# Altium schematic sheet ADC.SchDoc
size A4
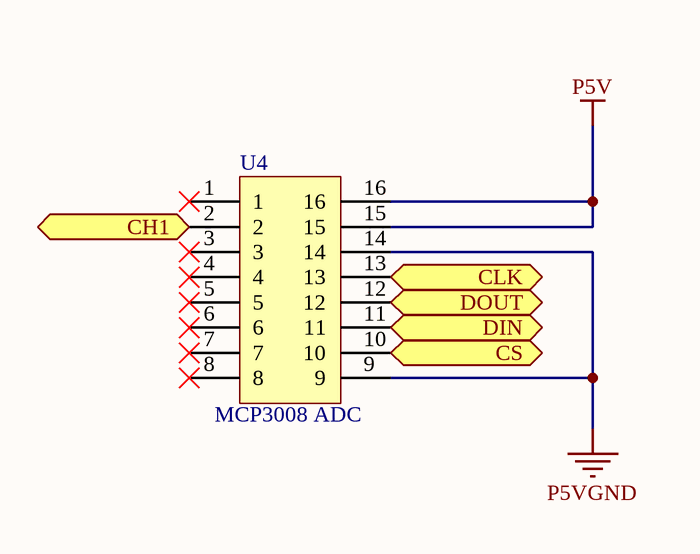
[diagram p0: ADC.SchDoc]

## Parts
U4  MCP3008 ADC  [ISDIP16_LGE1.0]

## Ports
CH1 (in), CLK (in), CS (in), DIN (in), DOUT (out)

## Nets
P5V: U4.15 U4.16
P5VGND: U4.9 U4.14
CH1: U4.2 ; port CH1
CLK: U4.13 ; port CLK
CS: U4.10 ; port CS
DIN: U4.11 ; port DIN
DOUT: U4.12 ; port DOUT

Not connected (* = marked no-connect by the designer): U4 1* 3* 4* 5* 6* 7* 8*

## Library data of the parts
U4 = G-DIP16: 16-pin DIP socket; Published: 13-Oct-2000; LatestRevisionDate: 17-Jul-2002; LatestRevisionNote: Re-released for DXP Platform.; DatasheetVersion: 19-Mar-1998; PackageVersion: Oct-1998; PackageReference: ISDIP28; Publisher: Altium Limited; PackageDescription: DIP; 28 Rectangular Pins; Row Space 15.24 mm; Pitch 2.54 mm; ComponentLink1Description: Manufacturer Link; ComponentLink1URL: http://www.maxim-ic.com/; ComponentLink2Description: Datasheet; ComponentLink2URL: http://pdfserv.maxim-ic.com/en/ds/DS1213B.pdf; ComponentLink3Description: Discontinuation Notice; ComponentLink3URL: http://www.maxim-ic.com/qa/pdfs/non-obsolescence-letter.pdf